# Altium schematic sheet AudioAmplifier.SchDoc
size 420 x 297 mm; DocumentNumber: Audio output
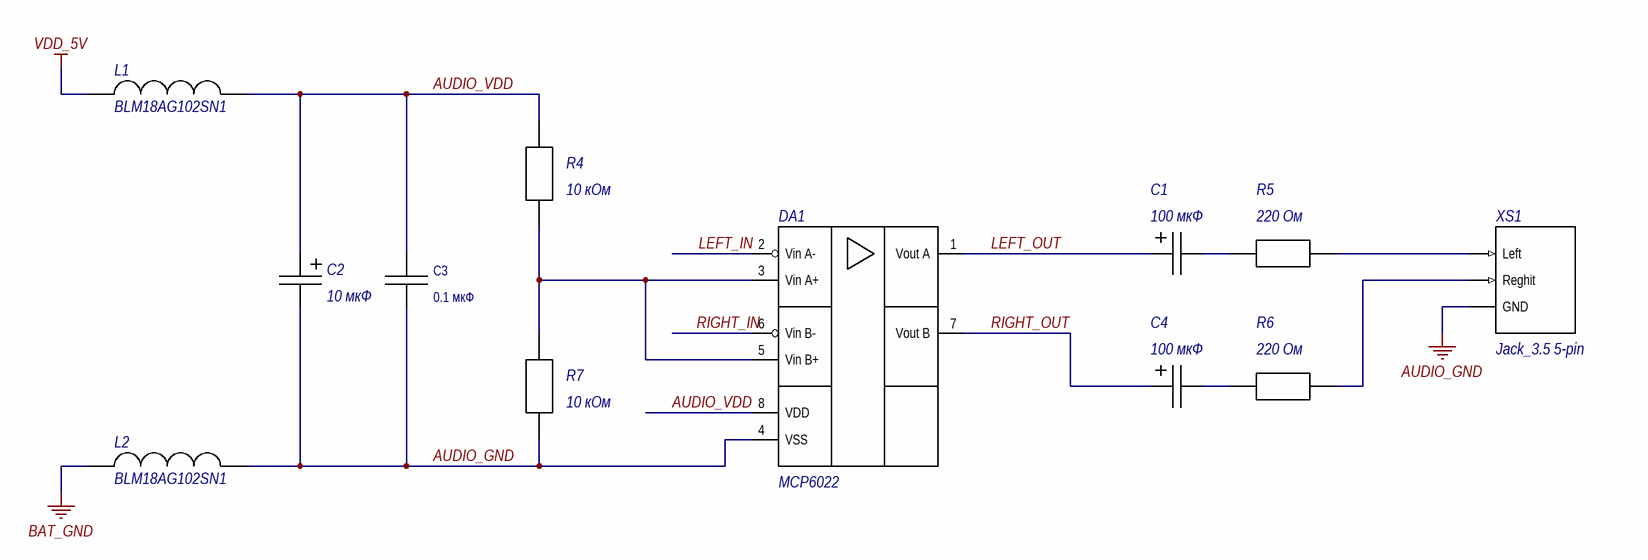
[diagram p0: AudioAmplifier.SchDoc]

## Parts
C1  100 мкФ  [C TAN_C]
C2  10 мкФ  [C TAN_A]
C3  0.1 мкФ  [C 1206]
C4  100 мкФ  [C TAN_C]
DA1  MCP6022  [SOIC-8]
L1  BLM18AG102SN1  [FB 0603]
L2  BLM18AG102SN1  [FB 0603]
R4  10 кОм  [RES 0805]
R5  220 Ом  [RES 0805]
R6  220 Ом  [RES 0805]
R7  10 кОм  [RES 0805]
XS1  Jack_3.5 5-pin  [JACK 3.5 DIP]

## Nets
AUDIO_GND: C2.2 C3.2 DA1.4(VSS) L2.2 R7.1 XS1.G(GND)
BAT_GND: L2.1
VDD_5V: L1.1
AUDIO_VDD: C2.1 C3.1 DA1.8(VDD) L1.2 R4.2
LEFT_IN: DA1.2(Vin_A-)
LEFT_OUT: C1.1 DA1.1(Vout_A)
RIGHT_IN: DA1.6(Vin_B-)
RIGHT_OUT: C4.1 DA1.7(Vout_B)
NetC1_2: C1.2 R5.1
NetC4_2: C4.2 R6.1
NetDA1_3: DA1.3(Vin_A+) DA1.5(Vin_B+) R4.1 R7.2
NetR5_2: R5.2 XS1.L(Left)
NetR6_2: R6.2 XS1.R(Reghit)

## Notes on the sheet
- Подп. и дата
- Инв. № дубл.
- Взам. инв. №
- Инв. № подл.
- Лист
- Изм.
- № докум.
- Подп.
- Дата
- Копировал
- Формат А3

## Library data of the parts
C1 C4 = CAP TAN_C: SMD Tantalium Capacitor C; Type: Конденсатор танталовый; Size: C
C2 = CAP TAN_A: SMD Tantalium Capacitor A; Type: Конденсатор танталовый; Rated voltage: 10 В; Size: A
C3 = CAP 1206: SMD Capacitor 1206; Manufacturer: /Укажите компанию-производителя/; Tolerance: /Укажите допуск в процентах/; Temperature coefficient: /Формат: ±? ppm/°C/; Type: Конденсатор керамический; TC: /Укажите тип диэлектрика/; Size: 1206; Temperature range: /Формат: -? ... ? °C/; Value: 0.1 мкФ
R4-R7 = RES 0805